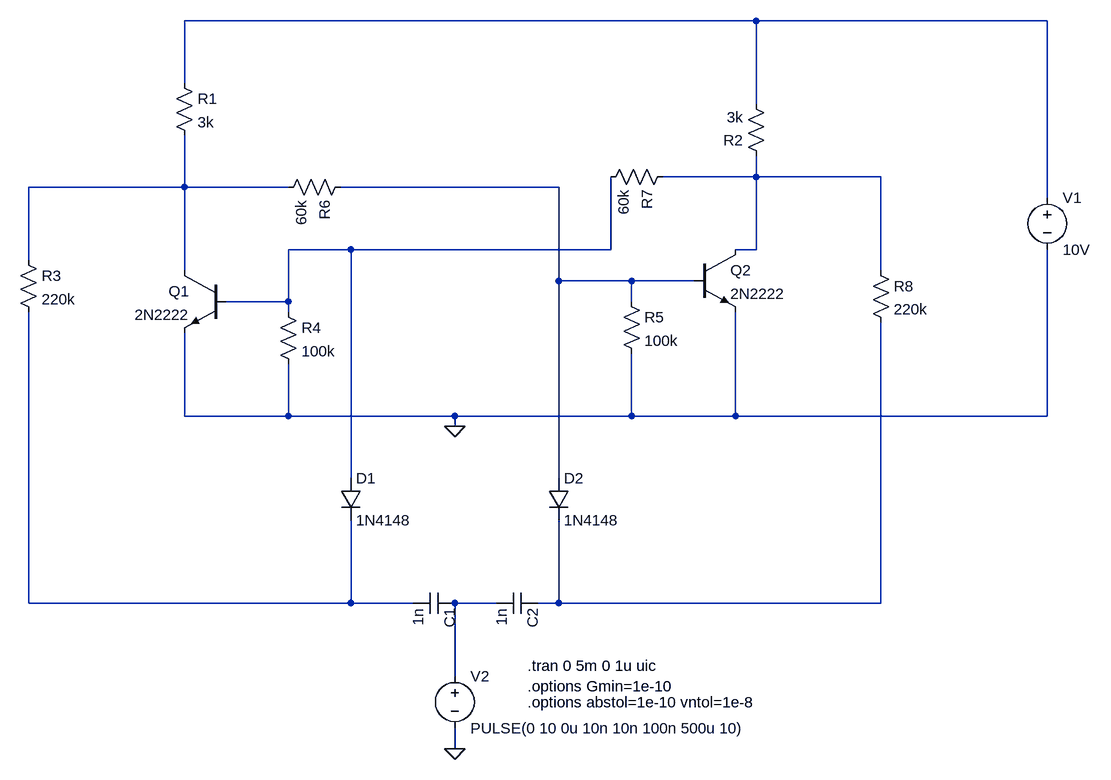
[diagram p0: schematic bistable vibrator.asc]
bistable vibrator.asc, the LTspice schematic file:
Version 4.1
SHEET 1 1240 852
WIRE 720 -288 -160 -288
WIRE 1168 -288 720 -288
WIRE -160 -192 -160 -288
WIRE 720 -160 720 -288
WIRE 720 -48 720 -80
WIRE 720 -48 576 -48
WIRE 912 -48 720 -48
WIRE -160 -32 -160 -112
WIRE -160 -32 -400 -32
WIRE 0 -32 -160 -32
WIRE 416 -32 80 -32
WIRE 1168 -16 1168 -288
WIRE 96 64 0 64
WIRE 496 64 496 -48
WIRE 496 64 96 64
WIRE 720 64 720 -48
WIRE 720 64 688 64
WIRE -400 80 -400 -32
WIRE -160 96 -160 -32
WIRE 912 96 912 -48
WIRE 416 112 416 -32
WIRE 528 112 416 112
WIRE 624 112 528 112
WIRE 0 144 0 64
WIRE 0 144 -96 144
WIRE 528 144 528 112
WIRE 0 160 0 144
WIRE -160 320 -160 192
WIRE 0 320 0 240
WIRE 0 320 -160 320
WIRE 256 320 0 320
WIRE 528 320 528 224
WIRE 528 320 256 320
WIRE 688 320 688 160
WIRE 688 320 528 320
WIRE 1168 320 1168 64
WIRE 1168 320 688 320
WIRE 256 336 256 320
WIRE 96 416 96 64
WIRE 416 416 416 112
WIRE -400 608 -400 160
WIRE 96 608 96 480
WIRE 96 608 -400 608
WIRE 192 608 96 608
WIRE 320 608 256 608
WIRE 416 608 416 480
WIRE 416 608 384 608
WIRE 912 608 912 176
WIRE 912 608 416 608
WIRE 256 720 256 608
WIRE 256 832 256 800
FLAG 256 336 0
FLAG 256 832 0
SYMBOL npn -96 96 M0
SYMATTR InstName Q1
SYMATTR Value 2N2222
SYMBOL npn 624 64 R0
SYMATTR InstName Q2
SYMATTR Value 2N2222
SYMBOL res -176 -208 R0
SYMATTR InstName R1
SYMATTR Value 3k
SYMBOL res 736 -64 R180
SYMATTR InstName R2
SYMATTR Value 3k
SYMBOL res -416 64 R0
SYMATTR InstName R3
SYMATTR Value 220k
SYMBOL res -16 144 R0
SYMATTR InstName R4
SYMATTR Value 100k
SYMBOL res 512 128 R0
SYMATTR InstName R5
SYMATTR Value 100k
SYMBOL res 96 -48 R90
SYMATTR InstName R6
SYMATTR Value 60k
SYMBOL res 592 -64 R90
SYMATTR InstName R7
SYMATTR Value 60k
SYMBOL res 896 80 R0
SYMATTR InstName R8
SYMATTR Value 220k
SYMBOL cap 256 592 R90
SYMATTR InstName C1
SYMATTR Value 1n
SYMATTR SpiceLine IC=1
SYMBOL cap 384 592 R90
SYMATTR InstName C2
SYMATTR Value 1n
SYMATTR SpiceLine IC=0
SYMBOL diode 80 416 R0
SYMATTR InstName D1
SYMATTR Value 1N4148
SYMBOL diode 400 416 R0
SYMATTR InstName D2
SYMATTR Value 1N4148
SYMBOL voltage 1168 -32 R0
SYMATTR InstName V1
SYMATTR Value 10V
SYMBOL voltage 256 704 R0
SYMATTR InstName V2
SYMATTR Value PULSE(0 10 0u 10n 10n 100n 500u 10)
TEXT 368 704 Left 2 !.tran 0 5m 0 1u uic
TEXT 368 736 Left 2 !.options Gmin=1e-10
TEXT 368 760 Left 2 !.options abstol=1e-10 vntol=1e-8

The netlist it stands for:
* bistable vibrator.asc
Q1 N003 N005 0 0 2N2222
Q2 N002 N004 0 0 2N2222
R1 N001 N003 3k
R2 N002 N001 3k
R3 N003 N006 220k
R4 N005 0 100k
R5 N004 0 100k
R6 N004 N003 60k
R7 N002 N005 60k
R8 N002 N008 220k
C1 N007 N006 1n IC=1
C2 N008 N007 1n IC=0
D1 N005 N006 1N4148
D2 N004 N008 1N4148
V1 N001 0 10V
V2 N007 0 PULSE(0 10 0u 10n 10n 100n 500u 10)
.model D D
.lib standard.dio
.model NPN NPN
.model PNP PNP
.lib standard.bjt
.tran 0 5m 0 1u uic
.options Gmin=1e-10
.options abstol=1e-10 vntol=1e-8
.backanno
.end